# Altium project projet_CAO.PrjPCB
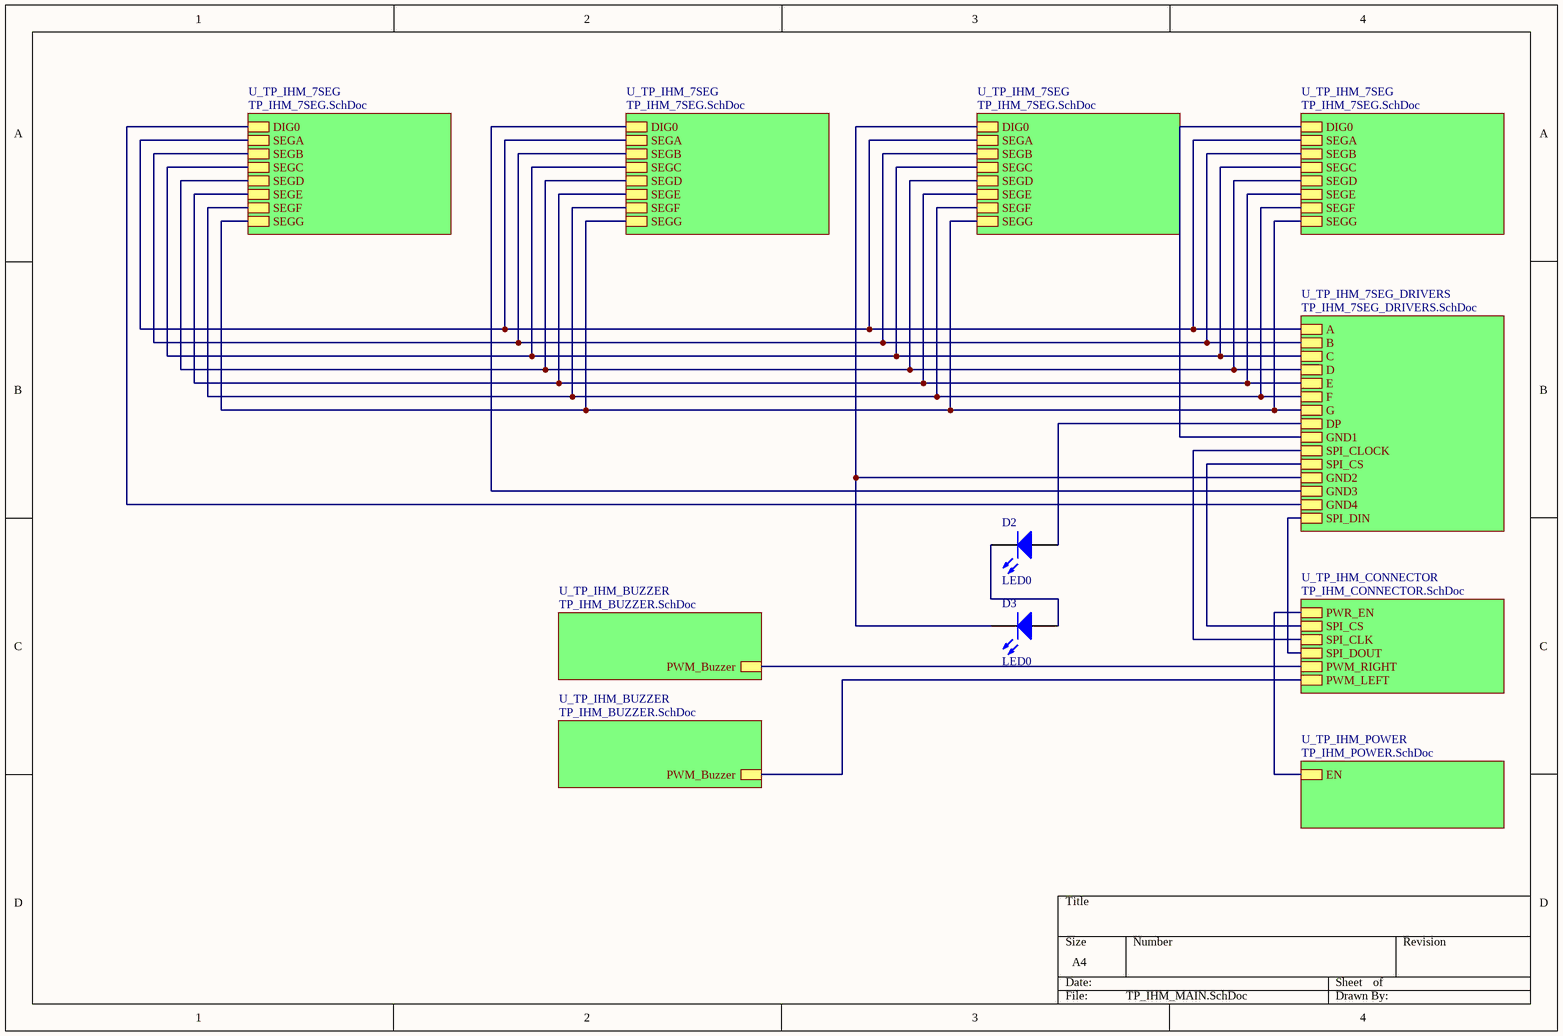
[diagram p0: TP_IHM_MAIN.SchDoc]
6 sheets, 55 parts. Net scope: hierarchical (ports join the sheet entries above them; power ports are global).
Board file: TPIhm.PcbDoc
Sheets:
  TP_IHM_MAIN.SchDoc
    U_TP_IHM_BUZZER = TP_IHM_BUZZER.SchDoc
    U_TP_IHM_CONNECTOR = TP_IHM_CONNECTOR.SchDoc
    U_TP_IHM_POWER = TP_IHM_POWER.SchDoc
    U_TP_IHM_7SEG_DRIVERS = TP_IHM_7SEG_DRIVERS.SchDoc
    U_TP_IHM_7SEG = TP_IHM_7SEG.SchDoc
    U_TP_IHM_7SEG = TP_IHM_7SEG.SchDoc
    U_TP_IHM_7SEG = TP_IHM_7SEG.SchDoc
    U_TP_IHM_BUZZER = TP_IHM_BUZZER.SchDoc
    U_TP_IHM_7SEG = TP_IHM_7SEG.SchDoc

## Sheet TP_IHM_MAIN.SchDoc
size A4

### Parts
D2  LED0  [LED-0]
D3  LED0  [LED-0]

### Sub-sheets
U_TP_IHM_7SEG = TP_IHM_7SEG.SchDoc: DIG0, SEGA, SEGB, SEGC, SEGD, SEGE, SEGF, SEGG
U_TP_IHM_7SEG = TP_IHM_7SEG.SchDoc: DIG0, SEGA, SEGB, SEGC, SEGD, SEGE, SEGF, SEGG
U_TP_IHM_7SEG = TP_IHM_7SEG.SchDoc: DIG0, SEGA, SEGB, SEGC, SEGD, SEGE, SEGF, SEGG
U_TP_IHM_7SEG = TP_IHM_7SEG.SchDoc: DIG0, SEGA, SEGB, SEGC, SEGD, SEGE, SEGF, SEGG
U_TP_IHM_7SEG_DRIVERS = TP_IHM_7SEG_DRIVERS.SchDoc: A, B, C, D, E, F, G, GND1, SPI_CLOCK, SPI_CS, GND2, GND3, GND4, SPI_DIN, DP
U_TP_IHM_BUZZER = TP_IHM_BUZZER.SchDoc: PWM_Buzzer
U_TP_IHM_BUZZER = TP_IHM_BUZZER.SchDoc: PWM_Buzzer
U_TP_IHM_CONNECTOR = TP_IHM_CONNECTOR.SchDoc: PWR_EN, SPI_CS, SPI_CLK, SPI_DOUT, PWM_RIGHT, PWM_LEFT
U_TP_IHM_POWER = TP_IHM_POWER.SchDoc: EN

### Nets
NetD2_1: D2.1(A) ; sheet U_TP_IHM_7SEG_DRIVERS/DP
NetD2_2: D2.2(K) D3.1(A)
NetD3_2: D3.2(K) ; sheet U_TP_IHM_7SEG_DRIVERS/GND2, sheet U_TP_IHM_7SEG/DIG0
NetIC1_1: sheet U_TP_IHM_CONNECTOR/SPI_DOUT, sheet U_TP_IHM_7SEG_DRIVERS/SPI_DIN
NetIC1_2: sheet U_TP_IHM_7SEG_DRIVERS/GND1, sheet U_TP_IHM_7SEG/DIG0
NetIC1_5: sheet U_TP_IHM_7SEG_DRIVERS/GND3, sheet U_TP_IHM_7SEG/DIG0
NetIC1_6: sheet U_TP_IHM_7SEG_DRIVERS/GND4, sheet U_TP_IHM_7SEG/DIG0
NetIC1_12: sheet U_TP_IHM_CONNECTOR/SPI_CS, sheet U_TP_IHM_7SEG_DRIVERS/SPI_CS
NetIC1_13: sheet U_TP_IHM_CONNECTOR/SPI_CLK, sheet U_TP_IHM_7SEG_DRIVERS/SPI_CLOCK
NetIC1_14: sheet U_TP_IHM_7SEG_DRIVERS/A, sheet U_TP_IHM_7SEG/SEGA, sheet U_TP_IHM_7SEG/SEGA, sheet U_TP_IHM_7SEG/SEGA, sheet U_TP_IHM_7SEG/SEGA
NetIC1_15: sheet U_TP_IHM_7SEG_DRIVERS/B, sheet U_TP_IHM_7SEG/SEGB, sheet U_TP_IHM_7SEG/SEGB, sheet U_TP_IHM_7SEG/SEGB, sheet U_TP_IHM_7SEG/SEGB
NetIC1_16: sheet U_TP_IHM_7SEG_DRIVERS/C, sheet U_TP_IHM_7SEG/SEGC, sheet U_TP_IHM_7SEG/SEGC, sheet U_TP_IHM_7SEG/SEGC, sheet U_TP_IHM_7SEG/SEGC
NetIC1_17: sheet U_TP_IHM_7SEG_DRIVERS/D, sheet U_TP_IHM_7SEG/SEGD, sheet U_TP_IHM_7SEG/SEGD, sheet U_TP_IHM_7SEG/SEGD, sheet U_TP_IHM_7SEG/SEGD
NetIC1_20: sheet U_TP_IHM_7SEG_DRIVERS/E, sheet U_TP_IHM_7SEG/SEGE, sheet U_TP_IHM_7SEG/SEGE, sheet U_TP_IHM_7SEG/SEGE, sheet U_TP_IHM_7SEG/SEGE
NetIC1_21: sheet U_TP_IHM_7SEG_DRIVERS/F, sheet U_TP_IHM_7SEG/SEGF, sheet U_TP_IHM_7SEG/SEGF, sheet U_TP_IHM_7SEG/SEGF, sheet U_TP_IHM_7SEG/SEGF
NetIC1_22: sheet U_TP_IHM_7SEG_DRIVERS/G, sheet U_TP_IHM_7SEG/SEGG, sheet U_TP_IHM_7SEG/SEGG, sheet U_TP_IHM_7SEG/SEGG, sheet U_TP_IHM_7SEG/SEGG
NetIC5_4: sheet U_TP_IHM_CONNECTOR/PWR_EN, sheet U_TP_IHM_POWER/EN
NetM1_U_TP_IHM_BUZZER#1_G: sheet U_TP_IHM_BUZZER/PWM_Buzzer, sheet U_TP_IHM_CONNECTOR/PWM_RIGHT
NetM1_U_TP_IHM_BUZZER#2_G: sheet U_TP_IHM_CONNECTOR/PWM_LEFT, sheet U_TP_IHM_BUZZER/PWM_Buzzer

### Library data of the parts
D2 D3 = LED0: Typical INFRARED GaAs LED; Published: 8-Jun-2000; LatestRevisionDate: 08-Jul-2005; LatestRevisionNote: Mech Layer 1 removed.; PackageReference: LED-0; Publisher: Altium Limited; PackageDescription: LED; 2 Leads

## Sheet TP_IHM_BUZZER.SchDoc
size A4
Used 2 times, as channels U_TP_IHM_BUZZER, U_TP_IHM_BUZZER. Parts and nets are listed once, with the designators drawn on the sheet.
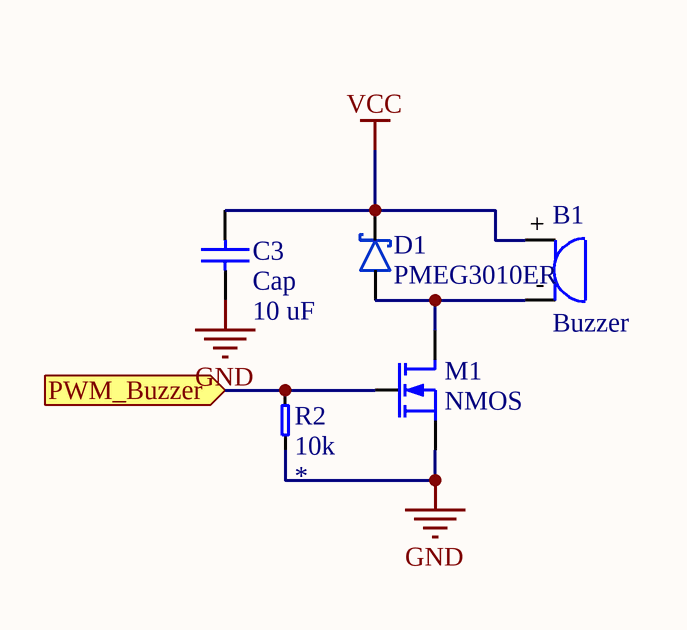
[diagram p1: TP_IHM_BUZZER.SchDoc]

### Parts
B1  Buzzer  [SD160709]
C3  Cap  value 10 uF  [RAD-0.3]
D1  PMEG3010ER  [SOD123W]
M1  NMOS  [MOSFET-SOT23]
R2  value 10k  [0603_RES_LD]  (hidden comment: Resistor)

### Ports
PWM_Buzzer

### Nets
GND: C3.1 M1.S R2.1
VCC: B1.+ C3.2 D1.K
PWM_Buzzer: M1.G R2.2 ; port PWM_Buzzer
NetB1_-: B1.- D1.A M1.D

### Channels
U_TP_IHM_BUZZER: designators end in _U_TP_IHM_BUZZER#1; ports PWM_Buzzer=NetM1_U_TP_IHM_BUZZER#1_G
U_TP_IHM_BUZZER: designators end in _U_TP_IHM_BUZZER#2; ports PWM_Buzzer=NetM1_U_TP_IHM_BUZZER#2_G

### Library data of the parts
B1 = SD160709: TDK SD160709 Buzzer; Reference: SD160709
C3 = Cap: Capacitor; Published: 8-Jun-2000; LatestRevisionDate: 17-Jul-2002; LatestRevisionNote: Re-released for DXP Platform.; PackageReference: RAD-0.3; Publisher: Altium Limited; PackageDescription: Radial Cap, Thru-Hole; 2 Leads; 0.3 in Pin Spacing
D1 = Schottky_PMEG3010ER: Nexperia 1A low Vf Mega Schottky barrier rectifier; Reference: PMEG3010ER
M1 = N-MOSFET: N MOSFET
R2 = Resistor: Precision: *; Package: *

## Sheet TP_IHM_CONNECTOR.SchDoc
size A4
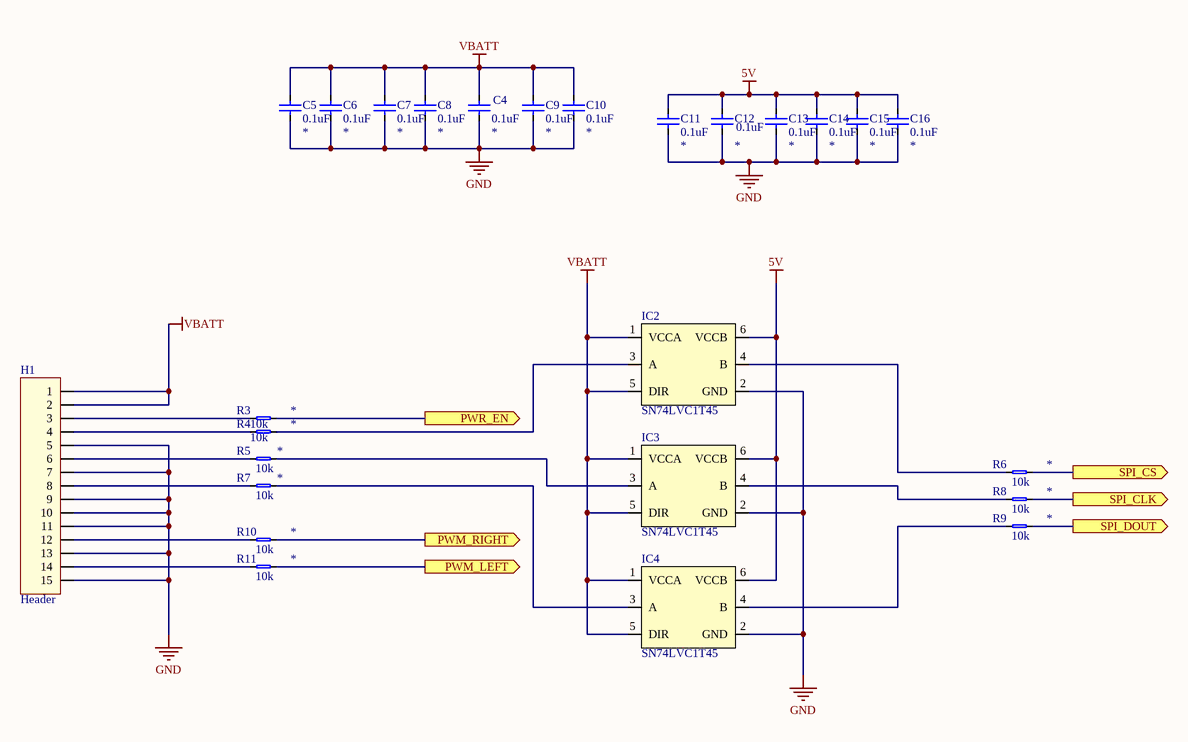
[diagram p2: TP_IHM_CONNECTOR.SchDoc]

### Parts
C4  value 0.1uF  [0402_CAP_LD]  (hidden comment: CerCap)
C5  value 0.1uF  [0603_CAP_LD]  (hidden comment: CerCap)
C6  value 0.1uF  [0603_CAP_LD]  (hidden comment: CerCap)
C7  value 0.1uF  [0603_CAP_LD]  (hidden comment: CerCap)
C8  value 0.1uF  [0603_CAP_LD]  (hidden comment: CerCap)
C9  value 0.1uF  [0402_CAP_LD]  (hidden comment: CerCap)
C10  value 0.1uF  [0402_CAP_LD]  (hidden comment: CerCap)
C11  value 0.1uF  [0603_CAP_LD]  (hidden comment: CerCap)
C12  value 0.1uF  [0603_CAP_LD]  (hidden comment: CerCap)
C13  value 0.1uF  [0603_CAP_LD]  (hidden comment: CerCap)
C14  value 0.1uF  [0402_CAP_LD]  (hidden comment: CerCap)
C15  value 0.1uF  [0402_CAP_LD]  (hidden comment: CerCap)
C16  value 0.1uF  [0402_CAP_LD]  (hidden comment: CerCap)
H1  Header  [653115131822]
IC2  SN74LVC1T45  [MO-203AB_LD]
IC3  SN74LVC1T45  [MO-203AB_LD]
IC4  SN74LVC1T45  [MO-203AB_LD]
R3  value 10k  [0603_RES_LD]  (hidden comment: Resistor)
R4  value 10k  [0603_RES_LD]  (hidden comment: Resistor)
R5  value 10k  [0603_RES_LD]  (hidden comment: Resistor)
R6  value 10k  [0603_RES_LD]  (hidden comment: Resistor)
R7  value 10k  [0603_RES_LD]  (hidden comment: Resistor)
R8  value 10k  [0603_RES_LD]  (hidden comment: Resistor)
R9  value 10k  [0603_RES_LD]  (hidden comment: Resistor)
R10  value 10k  [0603_RES_LD]  (hidden comment: Resistor)
R11  value 10k  [0603_RES_LD]  (hidden comment: Resistor)

### Ports
PWM_LEFT, PWM_RIGHT, PWR_EN, SPI_CLK, SPI_CS, SPI_DOUT

### Nets
5V: C11.2 C12.2 C13.2 C14.2 C15.2 C16.2 IC2.6(VCCB) IC3.6(VCCB) IC4.6(VCCB)
GND: C4.1 C5.2 C6.2 C7.2 C8.1 C9.1 C10.1 C11.1 C12.1 C13.1 C14.1 C15.1 C16.1 H1.5 H1.7 H1.9 H1.10 H1.11 H1.13 H1.15 IC2.2(GND) IC3.2(GND) IC4.2(GND)
VBATT: C4.2 C5.1 C6.1 C7.1 C8.2 C9.2 C10.2 H1.1 H1.2 IC2.1(VCCA) IC2.5(DIR) IC3.1(VCCA) IC3.5(DIR) IC4.1(VCCA) IC4.5(DIR)
NetH1_3: H1.3 R3.1
NetH1_4: H1.4 R4.1
NetH1_6: H1.6 R5.1
NetH1_8: H1.8 R7.1
NetH1_12: H1.12 R10.1
NetH1_14: H1.14 R11.1
NetIC1_1: R9.2 ; port SPI_DOUT
NetIC1_12: R6.2 ; port SPI_CS
NetIC1_13: R8.2 ; port SPI_CLK
NetIC2_3: IC2.3(A) R4.2
NetIC2_4: IC2.4(B) R6.1
NetIC3_3: IC3.3(A) R5.2
NetIC3_4: IC3.4(B) R8.1
NetIC4_3: IC4.3(A) R7.2
NetIC4_4: IC4.4(B) R9.1
NetIC5_4: R3.2 ; port PWR_EN
NetM1_U_TP_IHM_BUZZER#1_G: R10.2 ; port PWM_RIGHT
NetM1_U_TP_IHM_BUZZER#2_G: R11.2 ; port PWM_LEFT

### Library data of the parts
C4-C16 = CerCap: Ceramic Capacitor; Type: *; Voltage/Power: *; Package: *
H1 = HEADER_15x1: Header 15x1
IC2-IC4 = SN74LVC1T45: Single Bit Dual Supply Buffer
R3-R11 = Resistor: Precision: *; Package: *

## Sheet TP_IHM_POWER.SchDoc
size A4
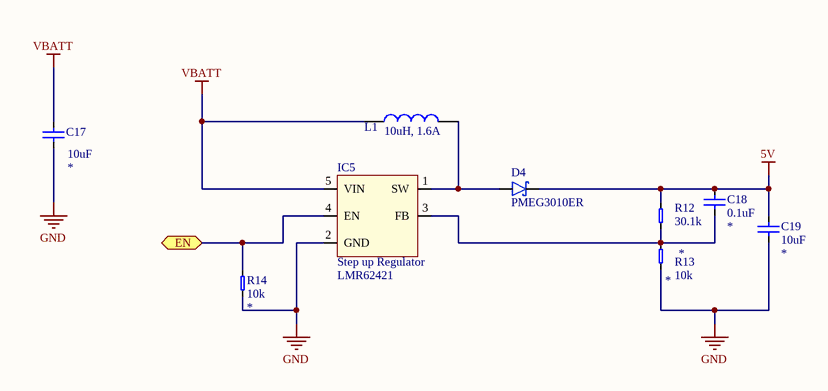
[diagram p3: TP_IHM_POWER.SchDoc]

### Parts
C17  value 10uF  [0603_CAP_LD]  (hidden comment: CerCap)
C18  value 0.1uF  [0603_CAP_LD]  (hidden comment: CerCap)
C19  value 10uF  [0603_CAP_LD]  (hidden comment: CerCap)
D4  PMEG3010ER  [SOD123W]
IC5  Step up Regulator  [LMR62421]
L1  10uH, 1.6A  [INDUCTOR_WE-LQS_5020]
R12  value 30.1k  [0603_RES_LD]  (hidden comment: Resistor)
R13  value 10k  [0603_RES_LD]  (hidden comment: Resistor)
R14  value 10k  [0603_RES_LD]  (hidden comment: Resistor)

### Ports
EN

### Nets
5V: C18.2 C19.2 D4.K R12.2
GND: C17.1 C19.1 IC5.2(GND) R13.1 R14.1
VBATT: C17.2 IC5.5(VIN) L1.1
NetC18_1: C18.1 IC5.3(FB) R12.1 R13.2
NetD4_A: D4.A IC5.1(SW) L1.2
NetIC5_4: IC5.4(EN) R14.2 ; port EN

### Library data of the parts
C17-C19 = CerCap: Ceramic Capacitor; Type: *; Voltage/Power: *; Package: *
D4 = Schottky_PMEG3010ER: as D1 on sheet TP_IHM_BUZZER; Reference: PMEG3010ER
IC5 = LMR62421XMF: LMR62421 simple switcher 24 Vout stepup voltage SOT-23; Reference: LMR62421
L1 = INDUCTOR_74404052100: WE-LQS SMD Power Inductor, size 5020, 10uH, 1.6A; DC Resistance: 109mOhm; Inductance Tolerance: +/-20%; Saturation Current: 1.95A; Self Resonant Frequency: 37MHz; ComponentLink1Description: Manufacturer; ComponentLink1URL: http://www.we-online.de; ComponentLink2Description: Datasheet; ComponentLink2URL: https://katalog.we-online.com/pbs/datasheet/74404052100.pdf; Part Number: 74404052100; Published Date: May 2019; Publisher: Wurth Elektronik; Rated Current: 1.6A; Inductance: 10uH; Operating Temperature: -40 to +125degC; Mounting Technology: SMT; Packaging: Tape and Reel; DC Resistance Tolerance: +/-20%; Size: 5020; Reference: 74404052100
R12-R14 = Resistor: Precision: *; Package: *

## Sheet TP_IHM_7SEG_DRIVERS.SchDoc
size A4
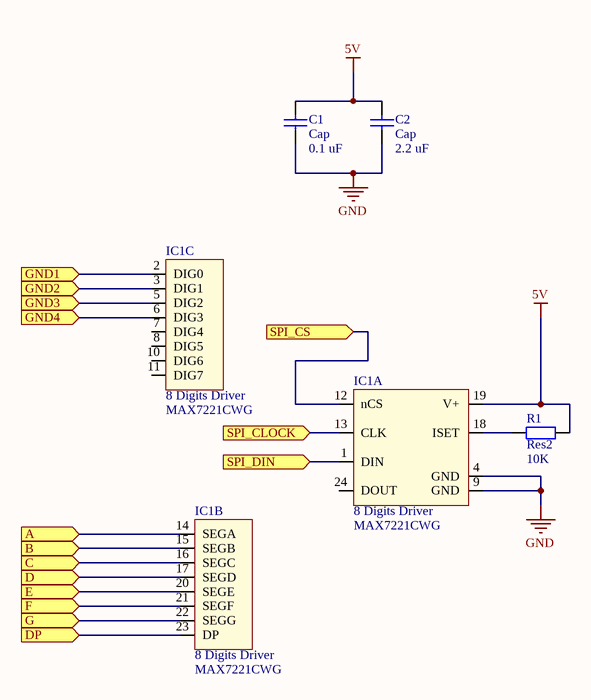
[diagram p4: TP_IHM_7SEG_DRIVERS.SchDoc]

### Parts
C1  Cap  value 0.1 uF  [RAD-0.3]
C2  Cap  value 2.2 uF  [RAD-0.3]
IC1  8 Digits Driver  [MAX7221CWG]  (parts A,B,C of 3)
R1  Res2  value 10K  [AXIAL-0.4]

### Ports
A, B, C, D, DP, E, F, G, GND1, GND2, GND3, GND4, SPI_CLOCK, SPI_CS, SPI_DIN

### Nets
5V: C1.2 C2.2 IC1.19(V+) R1.1
GND: C1.1 C2.1 IC1.4(GND) IC1.9(GND)
NetD2_1: IC1.23(DP) ; port DP
NetD3_2: IC1.3(DIG1) ; port GND2
NetIC1_1: IC1.1(DIN) ; port SPI_DIN
NetIC1_2: IC1.2(DIG0) ; port GND1
NetIC1_5: IC1.5(DIG2) ; port GND3
NetIC1_6: IC1.6(DIG3) ; port GND4
NetIC1_12: IC1.12(nCS) ; port SPI_CS
NetIC1_13: IC1.13(CLK) ; port SPI_CLOCK
NetIC1_14: IC1.14(SEGA) ; port A
NetIC1_15: IC1.15(SEGB) ; port B
NetIC1_16: IC1.16(SEGC) ; port C
NetIC1_17: IC1.17(SEGD) ; port D
NetIC1_18: IC1.18(ISET) R1.2
NetIC1_20: IC1.20(SEGE) ; port E
NetIC1_21: IC1.21(SEGF) ; port F
NetIC1_22: IC1.22(SEGG) ; port G

Not connected (* = marked no-connect by the designer): IC1 7(DIG4) 8(DIG5) 10(DIG6) 11(DIG7) 24(DOUT)

### Library data of the parts
C1 C2 = Cap: Capacitor; Published: 8-Jun-2000; LatestRevisionDate: 17-Jul-2002; LatestRevisionNote: Re-released for DXP Platform.; PackageReference: RAD-0.3; Publisher: Altium Limited; PackageDescription: Radial Cap, Thru-Hole; 2 Leads; 0.3 in Pin Spacing
IC1 = MAX7221: MAX7221 8 Digit 7 Segments Display; Reference: MAX7221CWG
R1 = Res2: Resistor; Published: 8-Jun-2000; LatestRevisionDate: 17-Jul-2002; LatestRevisionNote: Re-released for DXP Platform.; PackageReference: AXIAL-0.4; Publisher: Altium Limited; PackageDescription: Axial Device, Thru-Hole; 2 Leads; 0.4 in Pin Spacing

## Sheet TP_IHM_7SEG.SchDoc
size A4
Used 4 times, as channels U_TP_IHM_7SEG, U_TP_IHM_7SEG, U_TP_IHM_7SEG, U_TP_IHM_7SEG. Parts and nets are listed once, with the designators drawn on the sheet.
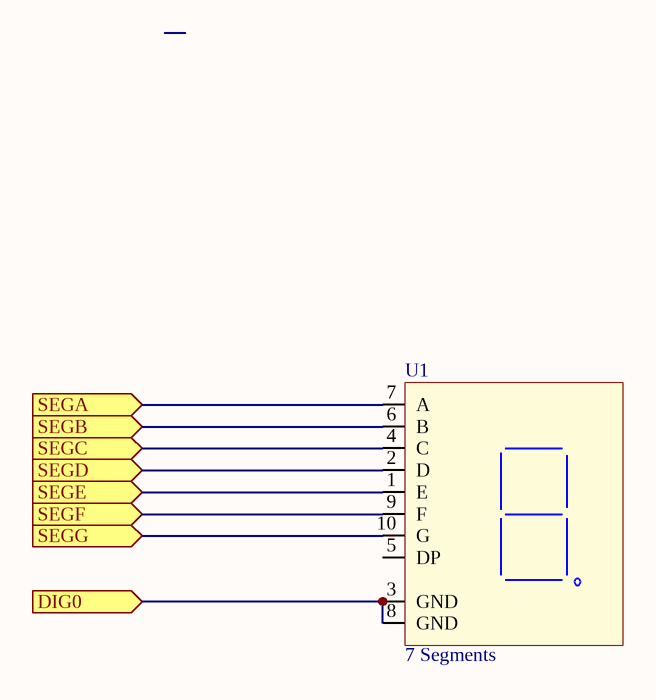
[diagram p5: TP_IHM_7SEG.SchDoc]

### Parts
U1  7 Segments  [SA10-21GWA]

### Ports
DIG0, SEGA, SEGB, SEGC, SEGD, SEGE, SEGF, SEGG

### Nets
DIG0: U1.3(GND) U1.8(GND) ; port DIG0
SEGA: U1.7(A) ; port SEGA
SEGB: U1.6(B) ; port SEGB
SEGC: U1.4(C) ; port SEGC
SEGD: U1.2(D) ; port SEGD
SEGE: U1.1(E) ; port SEGE
SEGF: U1.9(F) ; port SEGF
SEGG: U1.10(G) ; port SEGG

Not connected (* = marked no-connect by the designer): U1 5(DP)

### Channels
U_TP_IHM_7SEG: designators end in _U_TP_IHM_7SEG#1; ports DIG0=NetIC1_5 SEGA=NetIC1_14 SEGB=NetIC1_15 SEGC=NetIC1_16 SEGD=NetIC1_17 SEGE=NetIC1_20 SEGF=NetIC1_21 SEGG=NetIC1_22
U_TP_IHM_7SEG: designators end in _U_TP_IHM_7SEG#2; ports DIG0=NetD3_2 SEGA=NetIC1_14 SEGB=NetIC1_15 SEGC=NetIC1_16 SEGD=NetIC1_17 SEGE=NetIC1_20 SEGF=NetIC1_21 SEGG=NetIC1_22
U_TP_IHM_7SEG: designators end in _U_TP_IHM_7SEG#3; ports DIG0=NetIC1_2 SEGA=NetIC1_14 SEGB=NetIC1_15 SEGC=NetIC1_16 SEGD=NetIC1_17 SEGE=NetIC1_20 SEGF=NetIC1_21 SEGG=NetIC1_22
U_TP_IHM_7SEG: designators end in _U_TP_IHM_7SEG#4; ports DIG0=NetIC1_6 SEGA=NetIC1_14 SEGB=NetIC1_15 SEGC=NetIC1_16 SEGD=NetIC1_17 SEGE=NetIC1_20 SEGF=NetIC1_21 SEGG=NetIC1_22

### Library data of the parts
U1 = SC10-21SRWA: KingBright Led 7 Segments; Reference: SC10-21SRWA

## Nets that join several sheets
5V: TP_IHM_CONNECTOR (9 pins), TP_IHM_POWER (C18.2 C19.2 D4.K R12.2), TP_IHM_7SEG_DRIVERS (C1.2 C2.2 IC1.19 R1.1)
GND: U_TP_IHM_BUZZER (C3_U_TP_IHM_BUZZER#1.1 M1_U_TP_IHM_BUZZER#1.S R2_U_TP_IHM_BUZZER#1.1), TP_IHM_CONNECTOR (23 pins), TP_IHM_POWER (5 pins), TP_IHM_7SEG_DRIVERS (C1.1 C2.1 IC1.4 IC1.9), U_TP_IHM_BUZZER (C3_U_TP_IHM_BUZZER#2.1 M1_U_TP_IHM_BUZZER#2.S R2_U_TP_IHM_BUZZER#2.1)
VBATT: TP_IHM_CONNECTOR (15 pins), TP_IHM_POWER (C17.2 IC5.5 L1.1)
VCC: U_TP_IHM_BUZZER (B1_U_TP_IHM_BUZZER#1.+ C3_U_TP_IHM_BUZZER#1.2 D1_U_TP_IHM_BUZZER#1.K), U_TP_IHM_BUZZER (B1_U_TP_IHM_BUZZER#2.+ C3_U_TP_IHM_BUZZER#2.2 D1_U_TP_IHM_BUZZER#2.K)
NetD2_1: TP_IHM_MAIN (D2.1), TP_IHM_7SEG_DRIVERS (IC1.23)
NetD3_2: TP_IHM_MAIN (D3.2), TP_IHM_7SEG_DRIVERS (IC1.3), U_TP_IHM_7SEG (U1_U_TP_IHM_7SEG#2.3 U1_U_TP_IHM_7SEG#2.8)
NetIC1_1: TP_IHM_CONNECTOR (R9.2), TP_IHM_7SEG_DRIVERS (IC1.1)
NetIC1_2: TP_IHM_7SEG_DRIVERS (IC1.2), U_TP_IHM_7SEG (U1_U_TP_IHM_7SEG#3.3 U1_U_TP_IHM_7SEG#3.8)
NetIC1_5: TP_IHM_7SEG_DRIVERS (IC1.5), U_TP_IHM_7SEG (U1_U_TP_IHM_7SEG#1.3 U1_U_TP_IHM_7SEG#1.8)
NetIC1_6: TP_IHM_7SEG_DRIVERS (IC1.6), U_TP_IHM_7SEG (U1_U_TP_IHM_7SEG#4.3 U1_U_TP_IHM_7SEG#4.8)
NetIC1_12: TP_IHM_CONNECTOR (R6.2), TP_IHM_7SEG_DRIVERS (IC1.12)
NetIC1_13: TP_IHM_CONNECTOR (R8.2), TP_IHM_7SEG_DRIVERS (IC1.13)
NetIC1_14: TP_IHM_7SEG_DRIVERS (IC1.14), U_TP_IHM_7SEG (U1_U_TP_IHM_7SEG#1.7), U_TP_IHM_7SEG (U1_U_TP_IHM_7SEG#2.7), U_TP_IHM_7SEG (U1_U_TP_IHM_7SEG#3.7), U_TP_IHM_7SEG (U1_U_TP_IHM_7SEG#4.7)
NetIC1_15: TP_IHM_7SEG_DRIVERS (IC1.15), U_TP_IHM_7SEG (U1_U_TP_IHM_7SEG#1.6), U_TP_IHM_7SEG (U1_U_TP_IHM_7SEG#2.6), U_TP_IHM_7SEG (U1_U_TP_IHM_7SEG#3.6), U_TP_IHM_7SEG (U1_U_TP_IHM_7SEG#4.6)
NetIC1_16: TP_IHM_7SEG_DRIVERS (IC1.16), U_TP_IHM_7SEG (U1_U_TP_IHM_7SEG#1.4), U_TP_IHM_7SEG (U1_U_TP_IHM_7SEG#2.4), U_TP_IHM_7SEG (U1_U_TP_IHM_7SEG#3.4), U_TP_IHM_7SEG (U1_U_TP_IHM_7SEG#4.4)
NetIC1_17: TP_IHM_7SEG_DRIVERS (IC1.17), U_TP_IHM_7SEG (U1_U_TP_IHM_7SEG#1.2), U_TP_IHM_7SEG (U1_U_TP_IHM_7SEG#2.2), U_TP_IHM_7SEG (U1_U_TP_IHM_7SEG#3.2), U_TP_IHM_7SEG (U1_U_TP_IHM_7SEG#4.2)
NetIC1_20: TP_IHM_7SEG_DRIVERS (IC1.20), U_TP_IHM_7SEG (U1_U_TP_IHM_7SEG#1.1), U_TP_IHM_7SEG (U1_U_TP_IHM_7SEG#2.1), U_TP_IHM_7SEG (U1_U_TP_IHM_7SEG#3.1), U_TP_IHM_7SEG (U1_U_TP_IHM_7SEG#4.1)
NetIC1_21: TP_IHM_7SEG_DRIVERS (IC1.21), U_TP_IHM_7SEG (U1_U_TP_IHM_7SEG#1.9), U_TP_IHM_7SEG (U1_U_TP_IHM_7SEG#2.9), U_TP_IHM_7SEG (U1_U_TP_IHM_7SEG#3.9), U_TP_IHM_7SEG (U1_U_TP_IHM_7SEG#4.9)
NetIC1_22: TP_IHM_7SEG_DRIVERS (IC1.22), U_TP_IHM_7SEG (U1_U_TP_IHM_7SEG#1.10), U_TP_IHM_7SEG (U1_U_TP_IHM_7SEG#2.10), U_TP_IHM_7SEG (U1_U_TP_IHM_7SEG#3.10), U_TP_IHM_7SEG (U1_U_TP_IHM_7SEG#4.10)
NetIC5_4: TP_IHM_CONNECTOR (R3.2), TP_IHM_POWER (IC5.4 R14.2)
NetM1_U_TP_IHM_BUZZER#1_G: U_TP_IHM_BUZZER (M1_U_TP_IHM_BUZZER#1.G R2_U_TP_IHM_BUZZER#1.2), TP_IHM_CONNECTOR (R10.2)
NetM1_U_TP_IHM_BUZZER#2_G: TP_IHM_CONNECTOR (R11.2), U_TP_IHM_BUZZER (M1_U_TP_IHM_BUZZER#2.G R2_U_TP_IHM_BUZZER#2.2)